# Altium schematic sheet Pack_Interface.SchDoc
size A4; Organization: TESLA Motors, INC; Address1: 3500 Deer Creek Road; Address2: Palo Alto, CA; Address4: U.S.A.; SheetNumber: 8; SheetTotal: 7
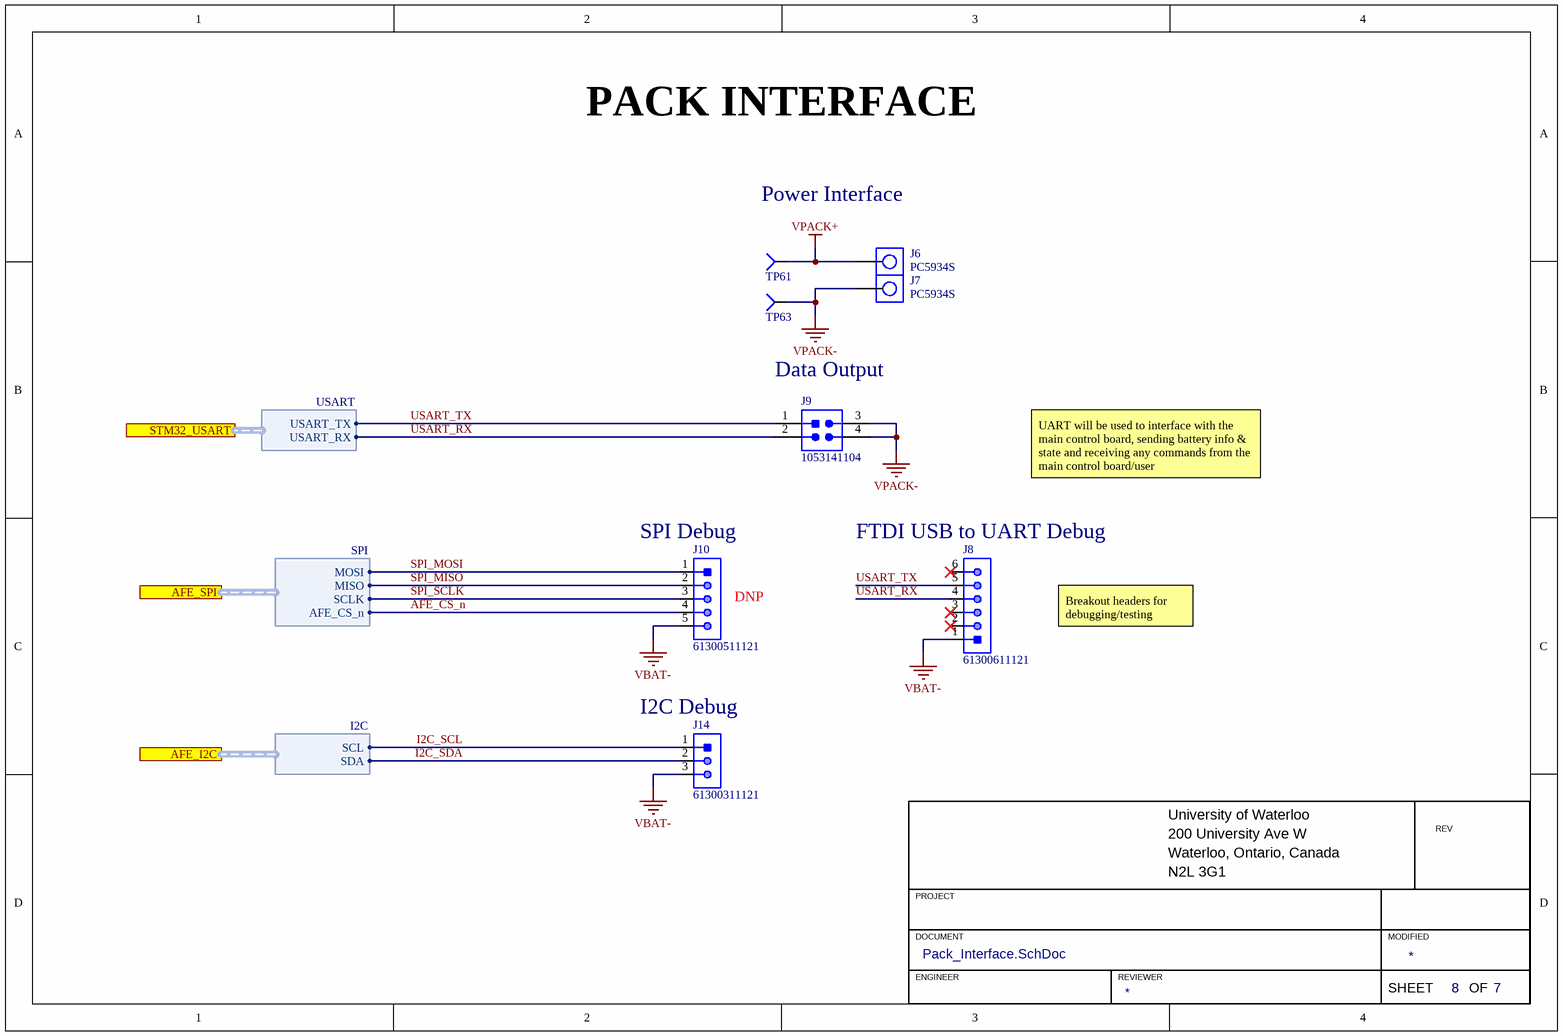
[diagram p0: Pack_Interface.SchDoc]

## Parts
J6  Manufacturer Part Number 1: PC5934S  [APP_PC5934S]  (hidden comment: CON_1POS_APP75)
J7  Manufacturer Part Number 1: PC5934S  [APP_PC5934S]  (hidden comment: CON_1POS_APP75)
J8  Manufacturer Part Number 1: 61300611121  [HDR1X6]  (hidden comment: HEADER 6x1)
J9  Manufacturer Part Number 1: 1053141104  [MOLEX-NANOFIT 2x2 THRA]  (hidden comment: 0430450412)
J10  Manufacturer Part Number 1: 61300511121  [HDR1X5]  (hidden comment: HEADER 5x1)
J14  Manufacturer Part Number 1: 61300311121  [HDR1X3]  (hidden comment: HEADER 3x1)
TP61  TESTPOINT_SMD_LOOP  [S1751-46R]  (value not drawn)
TP63  TESTPOINT_SMD_LOOP  [S1751-46R]  (value not drawn)

## Ports
AFE_I2C (harness I2C), AFE_SPI (harness SPI), STM32_USART (harness USART)

## Harnesses
USART: USART_TX, USART_RX
SPI: MOSI, MISO, SCLK, AFE_CS_n
I2C: SCL, SDA

## Nets
VBAT-: J8.1 J10.5 J14.3
VPACK+: J6.1 TP61.1(=value)
VPACK-: J7.1 J9.3 J9.4 TP63.1(=value)
AFE_CS_n: J10.4 ; port AFE_SPI.AFE_CS_n
I2C_SCL: J14.1 ; port AFE_I2C.SCL
I2C_SDA: J14.2 ; port AFE_I2C.SDA
SPI_MISO: J10.2 ; port AFE_SPI.MISO
SPI_MOSI: J10.1 ; port AFE_SPI.MOSI
SPI_SCLK: J10.3 ; port AFE_SPI.SCLK
USART_RX: J8.4 J9.2 ; port STM32_USART.USART_RX
USART_TX: J8.5 J9.1 ; port STM32_USART.USART_TX

Not connected (* = marked no-connect by the designer): J8 2* 3* 6*

## Notes on the sheet
- PACK INTERFACE
- Power Interface
- Data Output
- UART will be used to interface with the main control board, sending battery info & state and receiving any commands from the main control board/user
- (near J10) SPI Debug
- (near J8) FTDI USB to UART Debug
- (near J10) DNP
- Breakout headers for debugging/testing
- (near J14) I2C Debug
- University of Waterloo
- 200 University Ave W
- REV
- PROJECT
- Waterloo, Ontario, Canada
- N2L 3G1
- DOCUMENT
- ENGINEER
- REVIEWER
- MODIFIED
- SHEET
- OF

## Library data of the parts
J6 J7 = CON_1POS_APP75: TERM BLADE NON-GEND SILVER; Manufacturer 1: Anderson Power Products, Inc.; Voltage Rating: 600V; Current Rating: 55A; Supplier 1: Digi-Key; Supplier Part Number 1: 2243-PC5934S-ND
J8 = HEADER 6x1: CONN HEADER VERT 6POS 2.54MM; Manufacturer 1: Würth Elektronik; Supplier 1: Digi-Key; Mounting Type: TH; Pitch: 2.54mm; Supplier Part Number 1: 732-5319-ND
J9 = CON_MOLEX-NANOFIT_2x2_THRA: CONN HEADER R/A 4POS 2.5MM; Manufacturer 1: Molex; Voltage Rating: 250V; Current Rating: 7.5A; Pitch: 2.5mm; Supplier 1: Digi-Key; Supplier Part Number 1: WM16907-ND
J10 = HEADER 5x1: CONN HEADER VERT 5POS 2.54MM; Manufacturer 1: Würth Elektronik; Supplier 1: Digi-Key; Mounting Type: TH; Pitch: 2.54mm; Supplier Part Number 1: 732-5318-ND
J14 = HEADER 3x1: CONN HEADER VERT 3POS 2.54MM; Manufacturer 1: Würth Elektronik; Supplier 1: Digi-Key; Mounting Type: TH; Pitch: 2.54mm; Supplier Part Number 1: 732-5316-ND
TP61 TP63 = TESTPOINT_SMD_LOOP: TESTPOINT SMD LOOP; Manufacturer 1: Harwin; Supplier 1: Digi-Key; Manufacturer Part Number 1: S1751-46R; Mounting Type: SMD; Package/Footprint: SMD; Supplier Part Number 1: 952-1478-1-ND